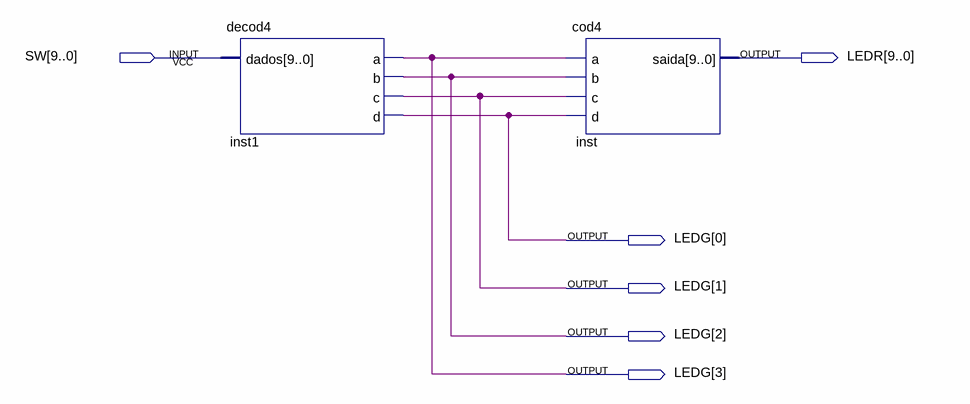
[diagram p0: schematic sheet]
// Quartus schematic Pre3.bdf as structural Verilog: 2 symbols, 6 pins
module Pre3 (
  input  [9:0] SW,
  output [9:0] LEDR,
  output [3:0] LEDG
);

  decod4 inst1 (.dados(SW), .a(LEDG[3]), .b(LEDG[2]), .c(LEDG[1]), .d(LEDG[0]));
  cod4 inst (.a(LEDG[3]), .b(LEDG[2]), .c(LEDG[1]), .d(LEDG[0]), .saida(LEDR));
endmodule
